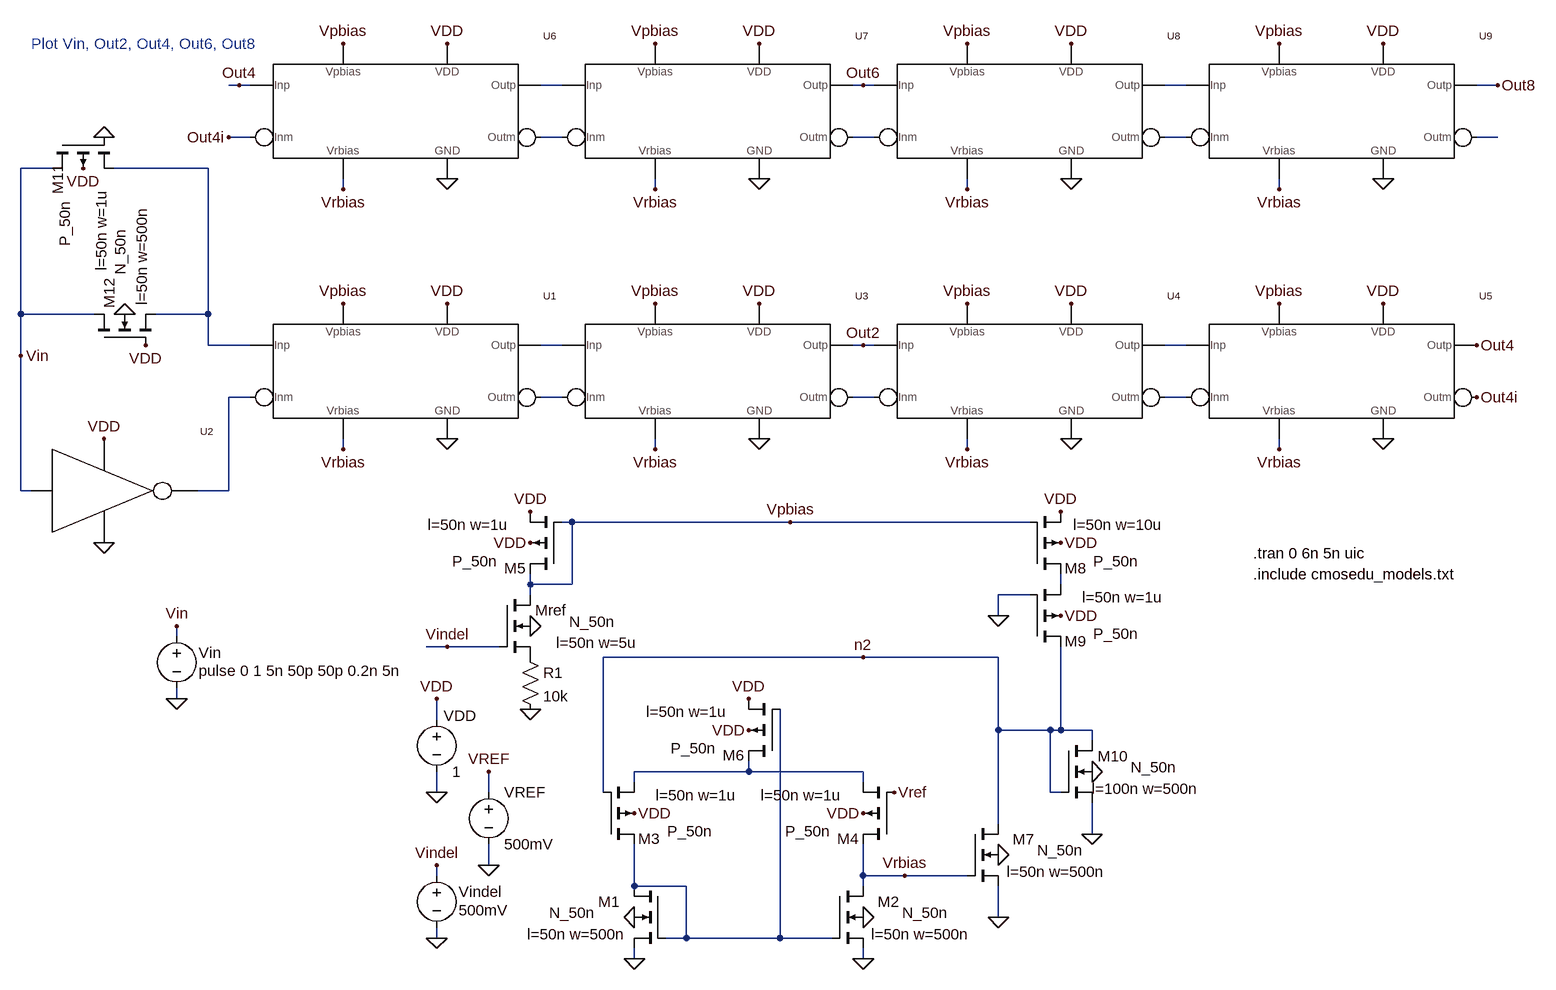
[diagram p0: schematic Fig19_62.asc]
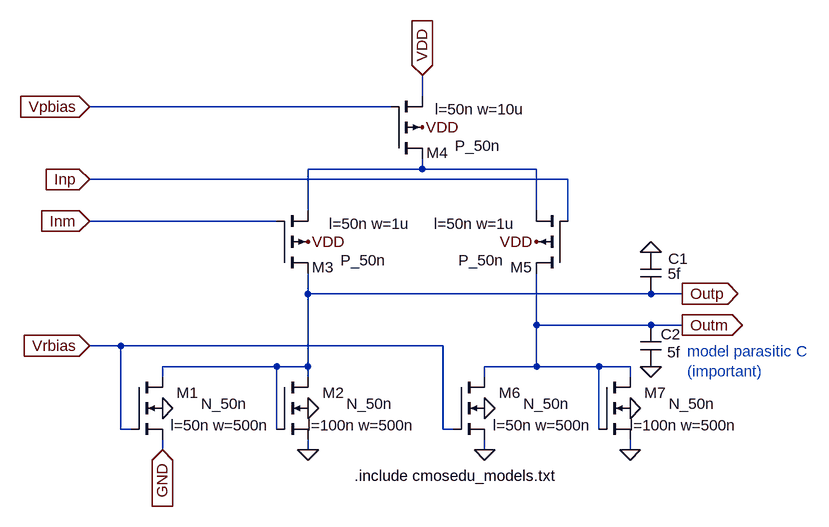
[diagram p1: sub-circuit delay.asc]
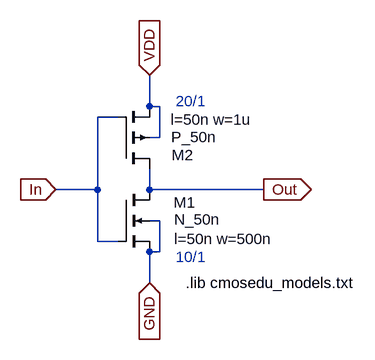
[diagram p2: sub-circuit inv_20_10.asc]
Fig19_62.asc, the LTspice schematic file:
Version 4
SHEET 1 4588 680
WIRE 656 -1792 640 -1792
WIRE 672 -1792 656 -1792
WIRE 1152 -1792 1120 -1792
WIRE 1616 -1792 1600 -1792
WIRE 1632 -1792 1616 -1792
WIRE 2112 -1792 2080 -1792
WIRE 2592 -1792 2560 -1792
WIRE 672 -1712 640 -1712
WIRE 1152 -1712 1120 -1712
WIRE 1632 -1712 1600 -1712
WIRE 2112 -1712 2080 -1712
WIRE 2592 -1712 2560 -1712
WIRE 368 -1664 320 -1664
WIRE 608 -1664 464 -1664
WIRE 816 -1632 816 -1648
WIRE 1296 -1632 1296 -1648
WIRE 1776 -1632 1776 -1648
WIRE 2256 -1632 2256 -1648
WIRE 320 -1440 320 -1664
WIRE 432 -1440 320 -1440
WIRE 608 -1440 608 -1664
WIRE 608 -1440 528 -1440
WIRE 608 -1392 608 -1440
WIRE 672 -1392 608 -1392
WIRE 1152 -1392 1120 -1392
WIRE 1616 -1392 1600 -1392
WIRE 1632 -1392 1616 -1392
WIRE 2112 -1392 2080 -1392
WIRE 320 -1376 320 -1440
WIRE 672 -1312 640 -1312
WIRE 1152 -1312 1120 -1312
WIRE 1632 -1312 1600 -1312
WIRE 2112 -1312 2080 -1312
WIRE 816 -1232 816 -1248
WIRE 1296 -1232 1296 -1248
WIRE 1776 -1232 1776 -1248
WIRE 2256 -1232 2256 -1248
WIRE 320 -1168 320 -1376
WIRE 336 -1168 320 -1168
WIRE 640 -1168 640 -1312
WIRE 640 -1168 592 -1168
WIRE 1168 -1120 1152 -1120
WIRE 1504 -1120 1168 -1120
WIRE 1872 -1120 1504 -1120
WIRE 1104 -1024 1104 -1040
WIRE 1168 -1024 1168 -1120
WIRE 1168 -1024 1104 -1024
WIRE 1920 -1024 1920 -1040
WIRE 1104 -1008 1104 -1024
WIRE 1872 -1008 1824 -1008
WIRE 1824 -976 1824 -1008
WIRE 560 -944 560 -960
WIRE 976 -928 944 -928
WIRE 1056 -928 976 -928
WIRE 1616 -912 1216 -912
WIRE 1824 -912 1616 -912
WIRE 560 -848 560 -864
WIRE 960 -816 960 -848
WIRE 1824 -800 1824 -912
WIRE 1904 -800 1824 -800
WIRE 1920 -800 1920 -928
WIRE 1920 -800 1904 -800
WIRE 1968 -800 1920 -800
WIRE 1968 -784 1968 -800
WIRE 1440 -736 1440 -752
WIRE 1440 -736 1264 -736
WIRE 1616 -736 1440 -736
WIRE 1264 -720 1264 -736
WIRE 1616 -720 1616 -736
WIRE 960 -704 960 -736
WIRE 1040 -704 1040 -736
WIRE 1216 -704 1216 -912
WIRE 1904 -704 1904 -800
WIRE 1920 -704 1904 -704
WIRE 1824 -656 1824 -800
WIRE 1968 -640 1968 -688
WIRE 1040 -592 1040 -624
WIRE 960 -576 960 -592
WIRE 1616 -576 1616 -624
WIRE 1680 -576 1616 -576
WIRE 1776 -576 1680 -576
WIRE 1264 -560 1264 -624
WIRE 1344 -560 1264 -560
WIRE 1616 -560 1616 -576
WIRE 1824 -512 1824 -560
WIRE 960 -480 960 -496
WIRE 1344 -480 1344 -560
WIRE 1344 -480 1312 -480
WIRE 1488 -480 1488 -832
WIRE 1488 -480 1344 -480
WIRE 1568 -480 1488 -480
WIRE 1264 -448 1264 -464
WIRE 1616 -448 1616 -464
FLAG 960 -480 0
FLAG 960 -592 Vindel
FLAG 1264 -512 0
FLAG 960 -704 0
FLAG 960 -848 VDD
FLAG 1264 -672 VDD
FLAG 1616 -672 VDD
FLAG 1616 -512 0
FLAG 1104 -1088 VDD
FLAG 1824 -608 0
FLAG 1824 -512 0
FLAG 1440 -800 VDD
FLAG 1440 -848 VDD
FLAG 1264 -448 0
FLAG 1616 -448 0
FLAG 1104 -1136 VDD
FLAG 1104 -960 0
FLAG 1104 -832 0
FLAG 976 -928 Vindel
FLAG 1040 -592 0
FLAG 1040 -736 VREF
FLAG 1920 -1088 VDD
FLAG 1920 -1136 VDD
FLAG 1920 -976 VDD
FLAG 1824 -976 0
FLAG 1968 -736 0
FLAG 1968 -640 0
FLAG 1664 -704 Vref
FLAG 1680 -576 Vrbias
FLAG 1616 -912 n2
FLAG 1504 -1120 Vpbias
FLAG 560 -848 0
FLAG 560 -960 Vin
FLAG 976 -1456 VDD
FLAG 976 -1248 0
FLAG 816 -1456 Vpbias
FLAG 816 -1232 Vrbias
FLAG 448 -1088 0
FLAG 448 -1248 VDD
FLAG 416 -1664 VDD
FLAG 480 -1440 0
FLAG 448 -1712 0
FLAG 512 -1392 VDD
FLAG 320 -1376 Vin
FLAG 1456 -1456 VDD
FLAG 1456 -1248 0
FLAG 1296 -1456 Vpbias
FLAG 1296 -1232 Vrbias
FLAG 1936 -1456 VDD
FLAG 1936 -1248 0
FLAG 1776 -1456 Vpbias
FLAG 1776 -1232 Vrbias
FLAG 2416 -1456 VDD
FLAG 2416 -1248 0
FLAG 2256 -1456 Vpbias
FLAG 2256 -1232 Vrbias
FLAG 976 -1856 VDD
FLAG 976 -1648 0
FLAG 816 -1856 Vpbias
FLAG 816 -1632 Vrbias
FLAG 1456 -1856 VDD
FLAG 1456 -1648 0
FLAG 1296 -1856 Vpbias
FLAG 1296 -1632 Vrbias
FLAG 1936 -1856 VDD
FLAG 1936 -1648 0
FLAG 1776 -1856 Vpbias
FLAG 1776 -1632 Vrbias
FLAG 2416 -1856 VDD
FLAG 2416 -1648 0
FLAG 2256 -1856 Vpbias
FLAG 2256 -1632 Vrbias
FLAG 1616 -1392 Out2
FLAG 656 -1792 Out4
FLAG 1616 -1792 Out6
FLAG 2592 -1792 Out8
FLAG 2560 -1392 Out4
FLAG 2560 -1312 Out4i
FLAG 640 -1712 Out4i
SYMBOL nmos4 1312 -560 M0
WINDOW 0 104 24 Right 2
WINDOW 3 179 41 Right 2
WINDOW 123 213 74 Right 2
SYMATTR InstName M1
SYMATTR Value N_50n
SYMATTR Value2 l=50n w=500n
SYMBOL voltage 960 -592 R0
WINDOW 0 34 41 Left 2
WINDOW 3 34 69 Left 2
WINDOW 123 0 0 Left 2
WINDOW 39 0 0 Left 2
SYMATTR InstName Vindel
SYMATTR Value 500mV
SYMBOL voltage 960 -832 R0
WINDOW 123 0 0 Left 2
WINDOW 39 0 0 Left 2
WINDOW 0 11 10 Left 2
SYMATTR InstName VDD
SYMATTR Value 1
SYMBOL pmos4 1216 -624 M180
WINDOW 0 88 9 Right 2
WINDOW 3 168 20 Right 2
WINDOW 123 206 76 Right 2
SYMATTR InstName M3
SYMATTR Value P_50n
SYMATTR Value2 l=50n w=1u
SYMBOL pmos4 1664 -624 R180
WINDOW 0 88 9 Right 2
WINDOW 3 168 20 Right 2
WINDOW 123 206 76 Right 2
SYMATTR InstName M4
SYMATTR Value P_50n
SYMATTR Value2 l=50n w=1u
SYMBOL nmos4 1568 -560 R0
WINDOW 0 104 24 Right 2
WINDOW 3 179 41 Right 2
WINDOW 123 213 74 Right 2
SYMATTR InstName M2
SYMATTR Value N_50n
SYMATTR Value2 l=50n w=500n
SYMBOL pmos4 1152 -1040 R180
WINDOW 0 88 9 Right 2
WINDOW 3 168 20 Right 2
WINDOW 123 206 76 Right 2
SYMATTR InstName M5
SYMATTR Value P_50n
SYMATTR Value2 l=50n w=1u
SYMBOL nmos4 1776 -656 R0
WINDOW 0 104 24 Right 2
WINDOW 3 179 41 Right 2
WINDOW 123 213 74 Right 2
SYMATTR InstName M7
SYMATTR Value N_50n
SYMATTR Value2 l=50n w=500n
SYMBOL pmos4 1488 -752 R180
WINDOW 0 88 9 Right 2
WINDOW 3 168 20 Right 2
WINDOW 123 206 76 Right 2
SYMATTR InstName M6
SYMATTR Value P_50n
SYMATTR Value2 l=50n w=1u
SYMBOL nmos4 1056 -1008 R0
WINDOW 0 104 24 Right 2
WINDOW 3 179 41 Right 2
WINDOW 123 213 74 Right 2
SYMATTR InstName Mref
SYMATTR Value N_50n
SYMATTR Value2 l=50n w=5u
SYMBOL res 1088 -928 R0
SYMATTR InstName R1
SYMATTR Value 10k
SYMBOL voltage 1040 -720 R0
WINDOW 123 0 0 Left 2
WINDOW 39 0 0 Left 2
SYMATTR InstName VREF
SYMATTR Value 500mV
SYMBOL pmos4 1872 -1040 M180
WINDOW 0 88 9 Right 2
WINDOW 3 168 20 Right 2
WINDOW 123 206 76 Right 2
SYMATTR InstName M8
SYMATTR Value P_50n
SYMATTR Value2 l=50n w=10u
SYMBOL pmos4 1872 -928 M180
WINDOW 0 88 9 Right 2
WINDOW 3 168 20 Right 2
WINDOW 123 206 76 Right 2
SYMATTR InstName M9
SYMATTR Value P_50n
SYMATTR Value2 l=50n w=1u
SYMBOL nmos4 1920 -784 R0
WINDOW 0 104 24 Right 2
WINDOW 3 179 41 Right 2
WINDOW 123 213 74 Right 2
SYMATTR InstName M10
SYMATTR Value N_50n
SYMATTR Value2 l=100n w=500n
SYMBOL voltage 560 -960 R0
WINDOW 0 34 41 Left 2
WINDOW 3 34 69 Left 2
WINDOW 123 0 0 Left 2
WINDOW 39 0 0 Left 2
SYMATTR InstName Vin
SYMATTR Value pulse 0 1 5n 50p 50p 0.2n 5n
SYMBOL delay 704 -1344 R0
SYMATTR InstName U1
SYMBOL INV_20_10 368 -1232 R0
SYMATTR InstName U2
SYMBOL pmos4 368 -1712 M90
WINDOW 0 88 9 Right 2
WINDOW 3 168 20 Right 2
WINDOW 123 206 76 Right 2
SYMATTR InstName M11
SYMATTR Value P_50n
SYMATTR Value2 l=50n w=1u
SYMBOL nmos4 432 -1392 R270
WINDOW 0 104 24 Right 2
WINDOW 3 179 41 Right 2
WINDOW 123 213 74 Right 2
SYMATTR InstName M12
SYMATTR Value N_50n
SYMATTR Value2 l=50n w=500n
SYMBOL delay 1184 -1344 R0
SYMATTR InstName U3
SYMBOL delay 1664 -1344 R0
SYMATTR InstName U4
SYMBOL delay 2144 -1344 R0
SYMATTR InstName U5
SYMBOL delay 704 -1744 R0
SYMATTR InstName U6
SYMBOL delay 1184 -1744 R0
SYMATTR InstName U7
SYMBOL delay 1664 -1744 R0
SYMATTR InstName U8
SYMBOL delay 2144 -1744 R0
SYMATTR InstName U9
TEXT 2216 -1072 Left 2 !.tran 0 6n 5n uic
TEXT 2216 -1040 Left 2 !.include cmosedu_models.txt
TEXT 336 -1856 Left 2 ;Plot Vin, Out2, Out4, Out6, Out8

delay.asc, the sub-circuit schematic file:
Version 4
SHEET 1 6288 680
WIRE 656 -608 656 -640
WIRE 608 -592 144 -592
WIRE 656 -496 656 -512
WIRE 656 -496 480 -496
WIRE 832 -496 656 -496
WIRE 880 -480 144 -480
WIRE 480 -432 480 -496
WIRE 832 -432 832 -496
WIRE 432 -416 144 -416
WIRE 880 -416 880 -480
WIRE 480 -304 480 -336
WIRE 1008 -304 480 -304
WIRE 1056 -304 1008 -304
WIRE 832 -256 832 -336
WIRE 1008 -256 832 -256
WIRE 1056 -256 1008 -256
WIRE 192 -224 144 -224
WIRE 688 -224 192 -224
WIRE 432 -192 256 -192
WIRE 480 -192 480 -304
WIRE 480 -192 432 -192
WIRE 832 -192 832 -256
WIRE 832 -192 752 -192
WIRE 928 -192 832 -192
WIRE 976 -192 928 -192
WIRE 256 -176 256 -192
WIRE 480 -176 480 -192
WIRE 752 -176 752 -192
WIRE 976 -176 976 -192
WIRE 192 -96 192 -224
WIRE 208 -96 192 -96
WIRE 432 -96 432 -192
WIRE 688 -96 688 -224
WIRE 704 -96 688 -96
WIRE 928 -96 928 -192
WIRE 256 -64 256 -80
WIRE 480 -64 480 -80
WIRE 752 -64 752 -80
WIRE 976 -64 976 -80
FLAG 256 -128 0
FLAG 656 -560 VDD
FLAG 480 -384 VDD
FLAG 480 -128 0
FLAG 144 -592 Vpbias
IOPIN 144 -592 In
FLAG 656 -640 VDD
IOPIN 656 -640 In
FLAG 832 -384 VDD
FLAG 144 -416 Inm
IOPIN 144 -416 In
FLAG 144 -480 Inp
IOPIN 144 -480 In
FLAG 480 -64 0
FLAG 752 -128 0
FLAG 976 -128 0
FLAG 976 -64 0
FLAG 752 -64 0
FLAG 144 -224 Vrbias
IOPIN 144 -224 In
FLAG 1056 -304 Outp
IOPIN 1056 -304 Out
FLAG 1056 -256 Outm
IOPIN 1056 -256 Out
FLAG 256 -64 GND
IOPIN 256 -64 In
FLAG 1008 -192 0
FLAG 1008 -368 0
SYMBOL nmos4 208 -176 R0
WINDOW 0 104 24 Right 0
WINDOW 3 179 41 Right 0
WINDOW 123 213 74 Right 0
SYMATTR InstName M1
SYMATTR Value N_50n
SYMATTR Value2 l=50n w=500n
SYMBOL pmos4 608 -512 M180
WINDOW 0 88 9 Right 0
WINDOW 3 168 20 Right 0
WINDOW 123 206 76 Right 0
SYMATTR InstName M4
SYMATTR Value P_50n
SYMATTR Value2 l=50n w=10u
SYMBOL pmos4 432 -336 M180
WINDOW 0 88 9 Right 0
WINDOW 3 168 20 Right 0
WINDOW 123 206 76 Right 0
SYMATTR InstName M3
SYMATTR Value P_50n
SYMATTR Value2 l=50n w=1u
SYMBOL nmos4 432 -176 R0
WINDOW 0 104 24 Right 0
WINDOW 3 179 41 Right 0
WINDOW 123 213 74 Right 0
SYMATTR InstName M2
SYMATTR Value N_50n
SYMATTR Value2 l=100n w=500n
SYMBOL pmos4 880 -336 R180
WINDOW 0 88 9 Right 0
WINDOW 3 168 20 Right 0
WINDOW 123 206 76 Right 0
SYMATTR InstName M5
SYMATTR Value P_50n
SYMATTR Value2 l=50n w=1u
SYMBOL nmos4 704 -176 R0
WINDOW 0 104 24 Right 0
WINDOW 3 179 41 Right 0
WINDOW 123 213 74 Right 0
SYMATTR InstName M6
SYMATTR Value N_50n
SYMATTR Value2 l=50n w=500n
SYMBOL nmos4 928 -176 R0
WINDOW 0 104 24 Right 0
WINDOW 3 179 41 Right 0
WINDOW 123 213 74 Right 0
SYMATTR InstName M7
SYMATTR Value N_50n
SYMATTR Value2 l=100n w=500n
SYMBOL cap 992 -368 R0
WINDOW 0 43 10 Left 0
WINDOW 3 42 33 Left 0
SYMATTR InstName C1
SYMATTR Value 5f
SYMBOL cap 992 -256 R0
WINDOW 0 31 14 Left 0
WINDOW 3 41 42 Left 0
SYMATTR InstName C2
SYMATTR Value 5f
TEXT 552 -24 Left 0 !.include cmosedu_models.txt
TEXT 1064 -216 Left 0 ;model parasitic C\n(important)

inv_20_10.asc, the sub-circuit schematic file:
Version 4
SHEET 1 1136 680
WIRE 448 -304 448 -352
WIRE 464 -304 448 -304
WIRE 400 -288 368 -288
WIRE 464 -256 464 -304
WIRE 464 -256 448 -256
WIRE 368 -176 368 -288
WIRE 368 -176 304 -176
WIRE 448 -176 448 -208
WIRE 624 -176 448 -176
WIRE 464 -128 448 -128
WIRE 368 -96 368 -176
WIRE 400 -96 368 -96
WIRE 464 -80 464 -128
WIRE 464 -80 448 -80
WIRE 448 -32 448 -80
FLAG 304 -176 In
IOPIN 304 -176 In
FLAG 448 -352 VDD
IOPIN 448 -352 In
FLAG 448 -32 GND
IOPIN 448 -32 In
FLAG 624 -176 Out
IOPIN 624 -176 Out
SYMBOL nmos4 400 -176 R0
WINDOW 0 119 20 Right 2
WINDOW 3 157 46 Right 2
WINDOW 123 238 76 Right 2
SYMATTR InstName M1
SYMATTR Value N_50n
SYMATTR Value2 l=50n w=500n
SYMBOL pmos4 400 -208 M180
WINDOW 0 116 21 Right 2
WINDOW 3 151 49 Right 2
WINDOW 123 206 76 Right 2
SYMATTR InstName M2
SYMATTR Value P_50n
SYMATTR Value2 l=50n w=1u
TEXT 488 -312 Left 2 ;20/1
TEXT 488 -72 Left 2 ;10/1
TEXT 504 -32 Left 2 !.lib cmosedu_models.txt

The netlist it stands for:
* Fig19_62.asc
M1 N016 N016 0 0 N_50n l=50n w=500n
Vindel Vindel 0 500mV
VDD VDD 0 1
M3 N016 n2 N015 VDD P_50n l=50n w=1u
M4 Vrbias VREF N015 VDD P_50n l=50n w=1u
M2 Vrbias N016 0 0 N_50n l=50n w=500n
M5 Vpbias Vpbias VDD VDD P_50n l=50n w=1u
M7 n2 Vrbias 0 0 N_50n l=50n w=500n
M6 N015 N016 VDD VDD P_50n l=50n w=1u
Mref Vpbias Vindel P001 0 N_50n l=50n w=5u
R1 P001 0 10k
VREF VREF 0 500mV
M8 N014 Vpbias VDD VDD P_50n l=50n w=10u
M9 n2 0 N014 VDD P_50n l=50n w=1u
M10 n2 n2 0 0 N_50n l=100n w=500n
Vin Vin 0 pulse 0 1 5n 50p 50p 0.2n 5n
XU1 N007 N010 N008 N011 Vpbias Vrbias VDD 0 delay
XU2 Vin N010 VDD 0 inv_20_10
M11 Vin 0 N007 VDD P_50n l=50n w=1u
M12 Vin VDD N007 0 N_50n l=50n w=500n
XU3 N008 N011 Out2 N012 Vpbias Vrbias VDD 0 delay
XU4 Out2 N012 N009 N013 Vpbias Vrbias VDD 0 delay
XU5 N009 N013 Out4 Out4i Vpbias Vrbias VDD 0 delay
XU6 Out4 Out4i N001 N003 Vpbias Vrbias VDD 0 delay
XU7 N001 N003 Out6 N004 Vpbias Vrbias VDD 0 delay
XU8 Out6 N004 N002 N005 Vpbias Vrbias VDD 0 delay
XU9 N002 N005 Out8 N006 Vpbias Vrbias VDD 0 delay

* block symbol definitions
.subckt delay Inp Inm Outp Outm Vpbias Vrbias VDD GND
M1 Outp Vrbias GND 0 N_50n l=50n w=500n
M4 N001 Vpbias VDD VDD P_50n l=50n w=10u
M3 Outp Inm N001 VDD P_50n l=50n w=1u
M2 Outp Outp 0 0 N_50n l=100n w=500n
M5 Outm Inp N001 VDD P_50n l=50n w=1u
M6 Outm Vrbias 0 0 N_50n l=50n w=500n
M7 Outm Outm 0 0 N_50n l=100n w=500n
C1 0 Outp 5f
C2 Outm 0 5f
.include cmosedu_models.txt
* model parasitic C
* (important)
.ends delay

.subckt inv_20_10 In Out VDD GND
M1 Out In GND GND N_50n l=50n w=500n
M2 Out In VDD VDD P_50n l=50n w=1u
* 20/1
* 10/1
.lib cmosedu_models.txt
.ends inv_20_10

.model NMOS NMOS
.model PMOS PMOS
.lib standard.mos
.tran 0 6n 5n uic
.include cmosedu_models.txt
* Plot Vin, Out2, Out4, Out6, Out8
.backanno
.end